# EAGLE design ac_dc_converter (EAGLE 9.6.2)
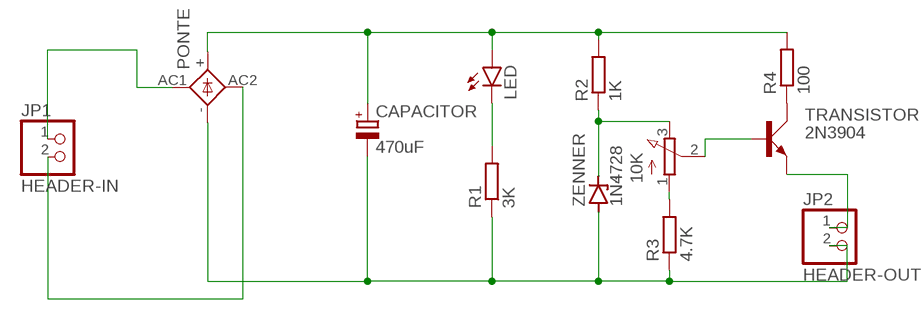
[diagram p0: schematic, sheet 1]

## Parts
CAPACITOR  470uF  CPOL-EUE5-10.5  [E5-10,5]
JP1  HEADER-IN  PINHD-1X2  [1X02]
JP2  HEADER-OUT  PINHD-1X2  [1X02]
LED  LED5MM  [LED5MM]
PONTE  1KAB  [1KAB]
R1  3K  R-EU_0204/7  [0204/7]
R2  1K  R-EU_0204/7  [0204/7]
R3  4.7K  R-EU_0204/7  [0204/7]
R4  100  R-EU_0204/7  [0204/7]
TRANSISTOR  2N3904  [TO92D]
ZENNER  1N4728  [DO41Z10]
¨  10K  3RP/1610N  [3RP/1610N]

## Nets
N$1: JP1.1 PONTE.AC1
N$2: CAPACITOR.+ LED.A PONTE.+ R2.2 R4.2
N$3: R2.1 ZENNER.C ¨.3(E)
N$4: CAPACITOR.- JP2.2 PONTE.- R1.1 R3.1 ZENNER.A
N$5: JP1.2 PONTE.AC2
N$6: LED.K(C) R1.2
N$7: TRANSISTOR.B ¨.2(S)
N$8: R4.1 TRANSISTOR.C
N$9: JP2.1 TRANSISTOR.E
N$10: R3.2 ¨.1(A)

## Library data of the parts
CAPACITOR = rcl:CPOL-EU: POLARIZED CAPACITOR, European symbol; SPICEPREFIX: C
JP1 JP2 = pinhead:PINHD-1X2: PIN HEADER
LED = led:LED: LED OSRAM: - CHIPLED LG R971, LG N971, LY N971, LG Q971, LY Q971, LO R971, LY R971 LH N974, LH R974 LS Q976, LO Q976, LY Q976 LO Q996 - Hyper CHIPLED LW Q18S LB Q993, LB Q99A, LB R99A - SideLED LS A670, LO A670, LY A670, LG A670, LP A670 LB A673, LV A673, LT A673, LW A673 LH A674 LY A675 LS A676, LA A676, LO A676, LY A676, LW A676 LS A679, LY A679, LG A679 - Hyper Micro SIDELED® LS Y876, LA Y876, LO Y876, LY Y876 LT Y87S - SmartLED LW L88C, LW L88S LB L89C, LB L89S, LG L890 LS L89K, LO L89K, LY L89K LS L896, LA L896, LO L896, LY L896 - TOPLED LS T670, LO T670, LY T670, LG T670, LP T670 LSG T670, LSP T670, LSY T670, LOP T670, LYG T670 LG T671, LOG T671, LSG T671 LB T673, LV T673, LT T673, LW T673 LH T674 LS T676, LA T676, LO T676, LY T676, LB T676, LH T676, LSB T676, LW T676 LB T67C, LV T67C, LT T67C, LS T67K, LO T67K, LY T67K, LW E67C LS E67B, LA E67B, LO E67B, LY E67B, LB E67C, LV E67C, LT E67C LW T67C LS T679, LY T679, LG T679 LS T770, LO T770, LY T770, LG T770, LP T770 LB T773, LV T773, LT T773, LW T773 LH T774 LS E675, LA E675, LY E675, LS T675 LS T776, LA T776, LO T776, LY T776, LB T776 LHGB T686 LT T68C, LB T68C - Hyper Mini TOPLED® LB M676 - Mini TOPLED Santana® LG M470 LS M47K, LO M47K, LY M47K Source: http://www.osram.convergy.de LUXEON: - LUMILED® LXK2-PW12-R00, LXK2-PW12-S00, LXK2-PW14-U00, LXK2-PW14-V00 LXK2-PM12-R00, LXK2-PM12-S00, LXK2-PM14-U00 LXK2-PE12-Q00, LXK2-PE12-R00, LXK2-PE12-S00, LXK2-PE14-T00, LXK2-PE14-U00 LXK2-PB12-K00, LXK2-PB12-L00, LXK2-PB12-M00, LXK2-PB14-N00, LXK2-PB14-P00, LXK2-PB14-Q00 LXK2-PR12-L00, LXK2-PR12-M00, LXK2-PR14-Q00, LXK2-PR14-R00 LXK2-PD12-Q00, LXK2-PD12-R00, LXK2-PD12-S00 LXK2-PH12-R00, LXK2-PH12-S00 LXK2-PL12-P00, LXK2-PL12-Q00, LXK2-PL12-R00 Source: www.luxeon.com KINGBRIGHT: KA-3528ASYC Source: www.kingbright.com
PONTE = rectifier:1KAB: RECTIFIER grid 5,08 x 5,08 mm
R1-R4 = rcl:R-EU_: RESISTOR, European symbol; SPICEPREFIX: R
TRANSISTOR = transistor-small-signal:2N3904: NPN TRANSISTOR
ZENNER = diode:1N4728: Z DIODE 3.3 V, 1W, 5 percent
¨ = pot:3RP/1610N: 16mm Potentiometer one level Source: http://www.alphapotentiometers.net/html/16mm_pot_2.html

## Board
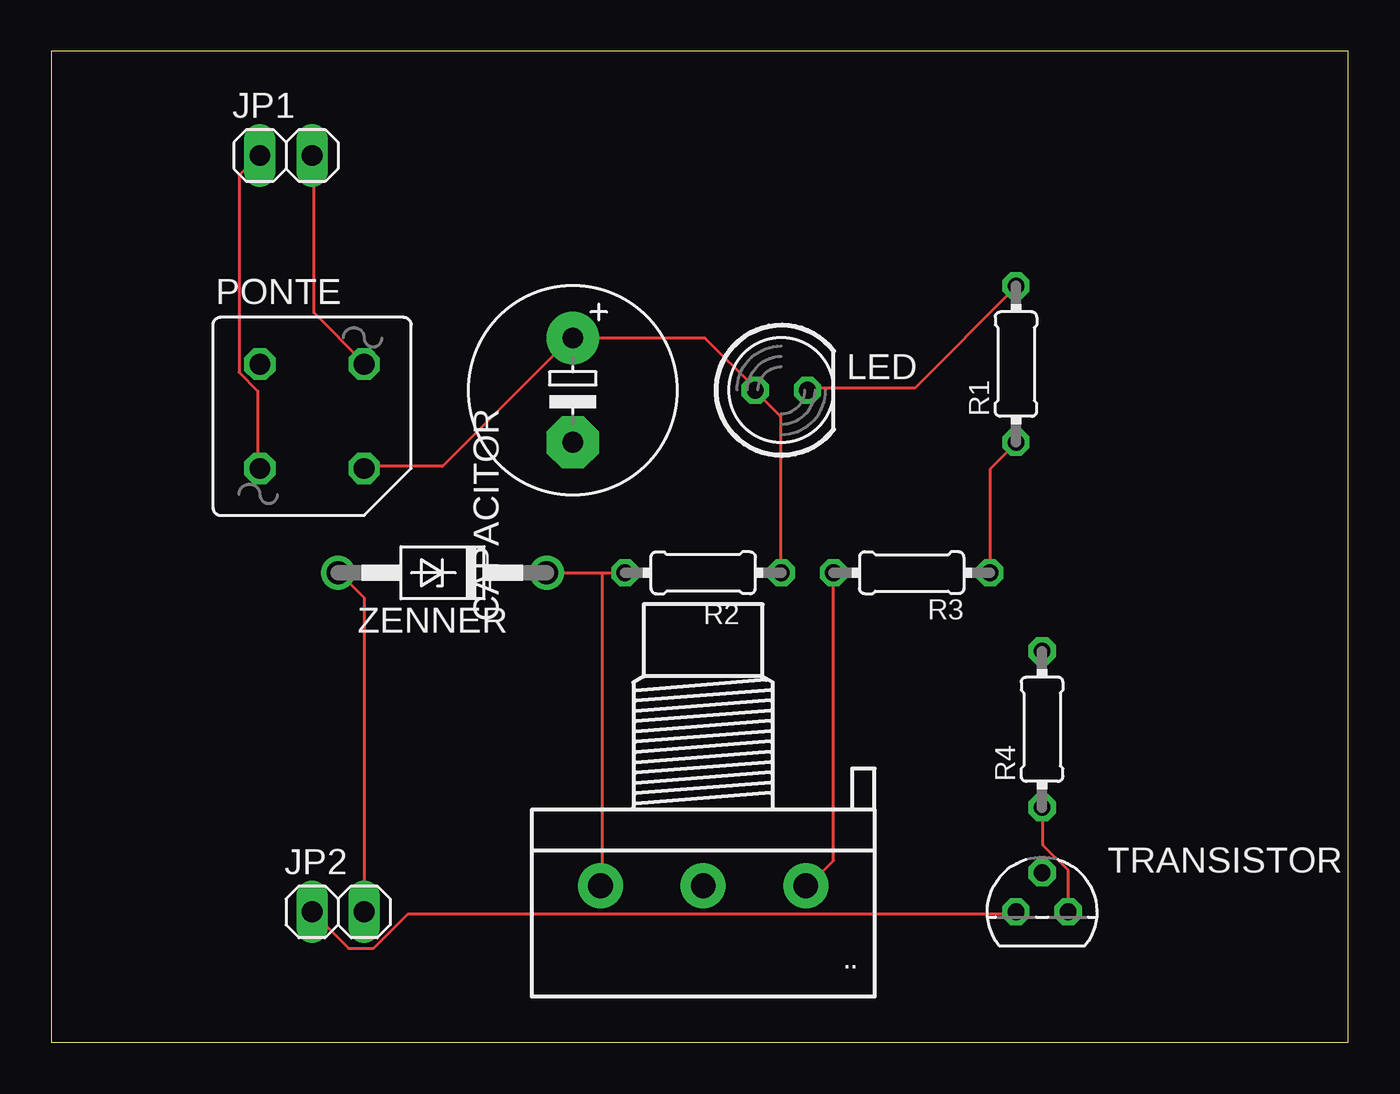
[diagram p1: board, top side]
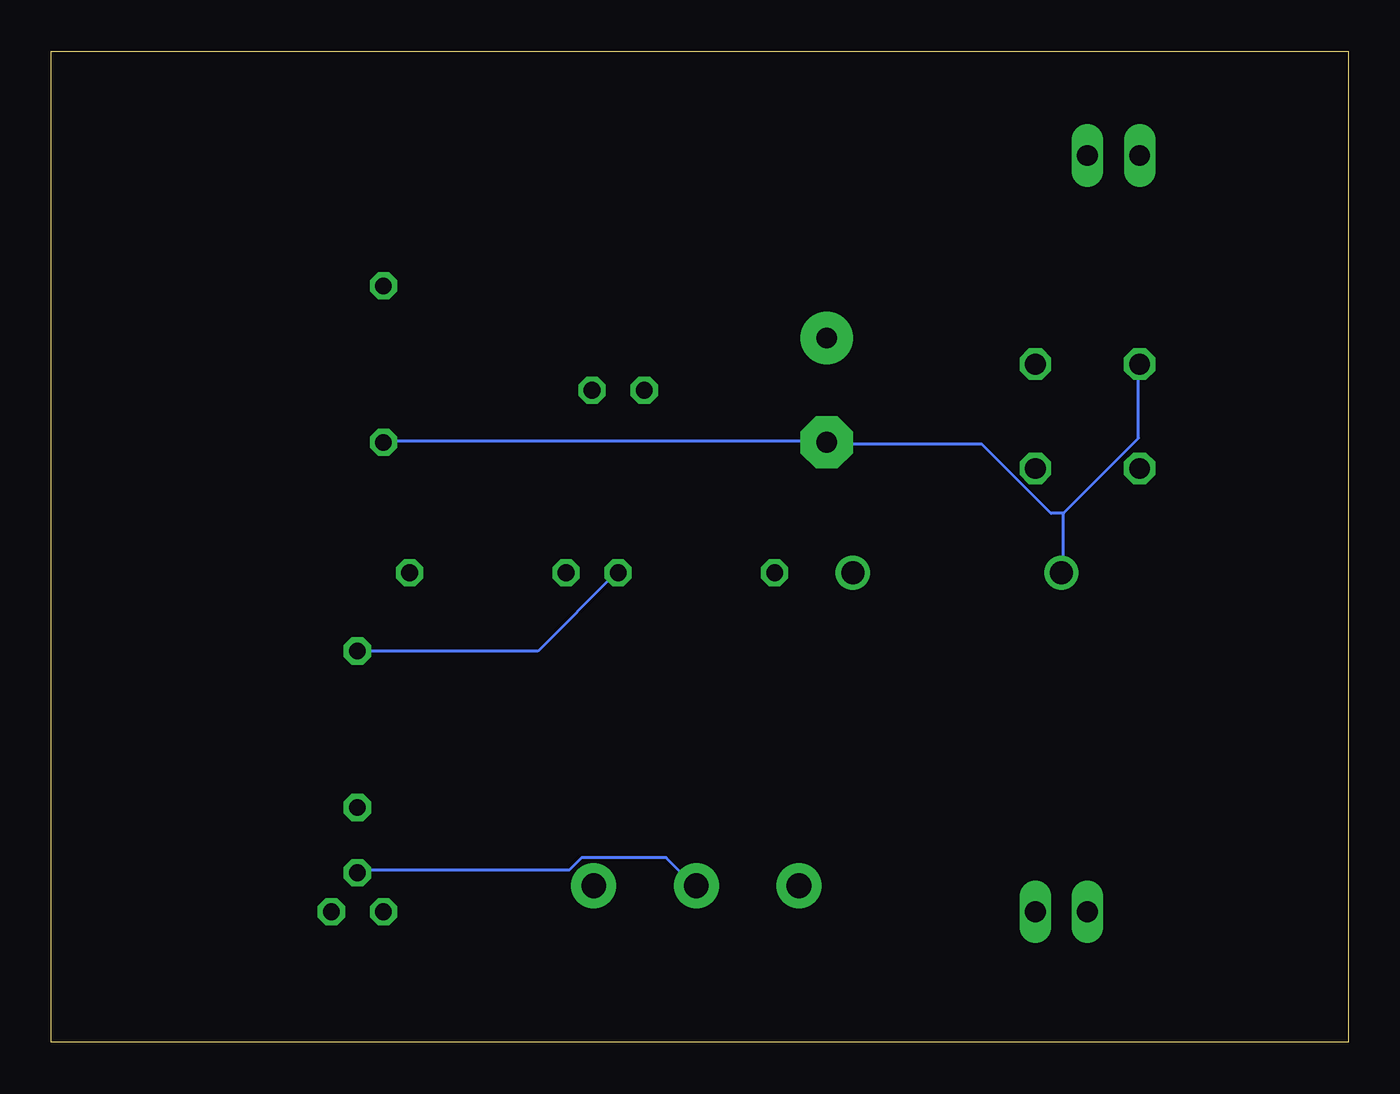
[diagram p2: board, bottom side, seen from below]

Size 63.17 x 48.25 mm. Coordinates in mm from the lower left corner, seen from the top.
Outline: 0,0 63.17,0 63.17,48.25 0,48.25 0,0
Copper layers (1*16): Top 0.035mm / dielectric 1.5mm / Bottom 0.035mm
Design rules "default": minimum track width 6mil, minimum drill 0.35mm, track to track 6mil, track to pad 6mil, pad to pad 6mil, via to via 6mil, smd to smd 6mil, copper to edge 40mil, drill to drill 6mil, minimum pad ring 10mil, minimum via ring 8mil, stop-mask expansion 4mil, vias tented up to drill 0mil, thermal gap 10mil

### Footprints (pad centres in the part's own frame; a part is rotated, then mirrored left to right if it is on the bottom)
E5-10,5 = drill 1.016 pad 2.54: + -2.54,0 | drill 1.016 pad 2.54 octagon: - 2.54,0
1X02 = drill 1.016 long: 1 -1.27,0; 2 1.27,0
LED5MM = drill 0.813 octagon: A -1.27,0; K 1.27,0
1KAB = drill 1.016 octagon: + 2.54,-2.54; - -2.54,2.54; AC1 -2.54,-2.54; AC2 2.54,2.54
0204/7 = drill 0.813 octagon: 1 -3.81,0; 2 3.81,0
TO92D = drill 0.813 octagon: B 0,1.905; C 1.27,0; E -1.27,0
DO41Z10 = drill 1.118: A 5.08,0; C -5.08,0
3RP/1610N = drill 1.2 pad 2.184: 1 -5,0; 2 0,0; 3 5,0

### Placement (x,y rotation side)
CAPACITOR  25.4,31.75 270 top
JP1  11.43,43.18 0 top
JP2  13.97,6.35 0 top
LED  35.56,31.75 0 top
PONTE  12.7,30.48 0 top
R1  46.99,33.02 90 top
R2  31.75,22.86 0 top
R3  41.91,22.86 180 top
R4  48.26,15.24 90 top
TRANSISTOR  48.26,6.35 0 top
ZENNER  19.05,22.86 180 top
¨  31.75,7.62 180 top

### Tracks (layer width: path | path; a pad name or v marks a point on that pad's centre or on a via)
N$1
  Top 0.152: PONTE.AC1 10.06,28.04 10.06,31.7 9.14,32.61 9.14,42.22 10.06,43.13 JP1.1
N$2
  Top 0.152: PONTE.+ 15.24,28.04 19.05,28.04 25.3,34.29 CAPACITOR.+ 31.85,34.29 34.29,31.85 LED.A 34.29,31.7 35.51,30.48 35.51,22.86 R2.2
  Bottom 0.152: R4.2 39.47,19.05 35.66,22.86 R2.2
N$3
  Top 0.152: ZENNER.C 26.82,22.86 | 26.82,22.86 R2.1 | 26.82,22.86 26.82,7.62 ¨.3
N$4
  Top 0.152: R3.1 45.72,27.89 46.94,29.11 R1.1 | JP2.2 15.24,21.64 14.02,22.86 ZENNER.A
  Bottom 0.152: 13.87,25.76 10.21,29.41 10.21,32.92 PONTE.- | 13.87,25.76 13.87,22.86 ZENNER.A | 13.87,25.76 14.48,25.76 17.83,29.11 25.3,29.11 CAPACITOR.- 25.45,29.26 46.94,29.26 R1.1
N$5
  Top 0.152: JP1.2 12.8,43.13 12.8,35.51 15.24,33.07 PONTE.AC2
N$6
  Top 0.152: LED.K 36.88,31.85 42.06,31.85 46.94,36.73 R1.2
N$7
  Bottom 0.152: TRANSISTOR.B 48.16,8.38 37.95,8.38 37.34,8.99 33.22,8.99 31.85,7.62 ¨.2
N$8
  Top 0.152: TRANSISTOR.C 49.53,8.38 48.31,9.6 48.31,11.43 R4.1
N$9
  Top 0.152: JP2.1 14.48,4.57 15.7,4.57 17.37,6.25 46.94,6.25 TRANSISTOR.E
N$10
  Top 0.152: R3.2 38.1,8.84 36.88,7.62 ¨.1